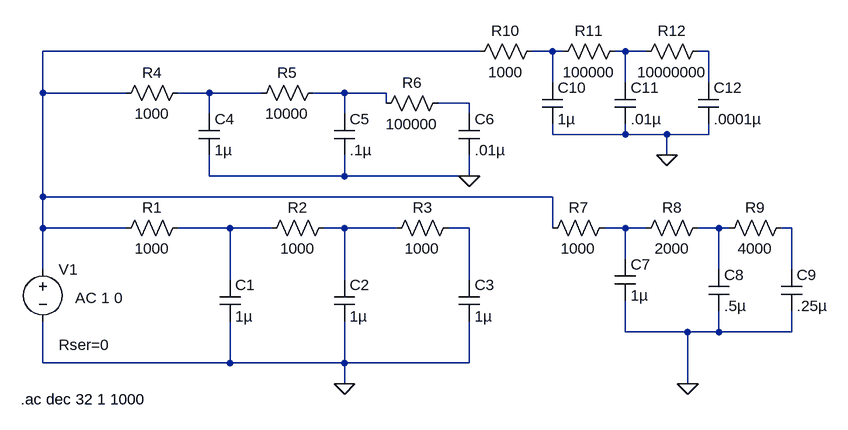
[diagram p0: schematic RCladder1.asc]
RCladder1.asc, the LTspice schematic file:
Version 4
SHEET 1 1252 680
WIRE 656 -192 -16 -192
WIRE 768 -192 736 -192
WIRE 784 -192 768 -192
WIRE 880 -192 864 -192
WIRE 912 -192 880 -192
WIRE 1008 -192 992 -192
WIRE 768 -144 768 -192
WIRE 880 -144 880 -192
WIRE 1008 -144 1008 -192
WIRE -16 -128 -16 -192
WIRE 112 -128 -16 -128
WIRE 240 -128 192 -128
WIRE 320 -128 240 -128
WIRE 448 -128 400 -128
WIRE 512 -128 448 -128
WIRE 512 -112 512 -128
WIRE 640 -112 592 -112
WIRE 240 -96 240 -128
WIRE 448 -96 448 -128
WIRE 640 -96 640 -112
WIRE 768 -64 768 -80
WIRE 880 -64 880 -80
WIRE 880 -64 768 -64
WIRE 944 -64 880 -64
WIRE 1008 -64 1008 -80
WIRE 1008 -64 944 -64
WIRE 944 -32 944 -64
WIRE 240 0 240 -32
WIRE 448 0 448 -32
WIRE 448 0 240 0
WIRE 640 0 640 -32
WIRE 640 0 448 0
WIRE -16 32 -16 -128
WIRE 768 32 -16 32
WIRE -16 80 -16 32
WIRE 112 80 -16 80
WIRE 272 80 192 80
WIRE 336 80 272 80
WIRE 448 80 416 80
WIRE 528 80 448 80
WIRE 640 80 608 80
WIRE 768 80 768 32
WIRE 880 80 848 80
WIRE 912 80 880 80
WIRE 1024 80 992 80
WIRE 1040 80 1024 80
WIRE 1136 80 1120 80
WIRE 880 128 880 80
WIRE -16 144 -16 80
WIRE 1024 144 1024 80
WIRE 1136 144 1136 80
WIRE 272 160 272 80
WIRE 448 160 448 80
WIRE 640 160 640 80
WIRE 880 240 880 192
WIRE 976 240 880 240
WIRE 1024 240 1024 208
WIRE 1024 240 976 240
WIRE 1136 240 1136 208
WIRE 1136 240 1024 240
WIRE -16 288 -16 224
WIRE 272 288 272 224
WIRE 272 288 -16 288
WIRE 448 288 448 224
WIRE 448 288 272 288
WIRE 640 288 640 224
WIRE 640 288 448 288
WIRE 448 320 448 288
WIRE 976 320 976 240
FLAG 448 320 0
FLAG 976 320 0
FLAG 640 0 0
FLAG 944 -32 0
SYMBOL voltage -16 128 R0
WINDOW 123 50 60 Left 0
WINDOW 39 24 132 Left 0
WINDOW 3 24 44 Left 0
SYMATTR Value2 AC 1 0
SYMATTR SpiceLine Rser=0
SYMATTR InstName V1
SYMATTR Value ""
SYMBOL cap 256 160 R0
SYMATTR InstName C1
SYMATTR Value 1µ
SYMATTR SpiceLine Rser=0.001
SYMBOL cap 432 160 R0
SYMATTR InstName C2
SYMATTR Value 1µ
SYMBOL cap 624 160 R0
SYMATTR InstName C3
SYMATTR Value 1µ
SYMBOL res 208 64 R90
WINDOW 0 0 56 VBottom 0
WINDOW 3 32 56 VTop 0
SYMATTR InstName R1
SYMATTR Value 1000
SYMBOL res 432 64 R90
WINDOW 0 0 56 VBottom 0
WINDOW 3 32 56 VTop 0
SYMATTR InstName R2
SYMATTR Value 1000
SYMBOL res 624 64 R90
WINDOW 0 0 56 VBottom 0
WINDOW 3 32 56 VTop 0
SYMATTR InstName R3
SYMATTR Value 1000
SYMBOL res 208 -144 R90
WINDOW 0 0 56 VBottom 0
WINDOW 3 32 56 VTop 0
SYMATTR InstName R4
SYMATTR Value 1000
SYMBOL res 416 -144 R90
WINDOW 0 0 56 VBottom 0
WINDOW 3 32 56 VTop 0
SYMATTR InstName R5
SYMATTR Value 10000
SYMBOL res 608 -128 R90
WINDOW 0 0 56 VBottom 0
WINDOW 3 32 56 VTop 0
SYMATTR InstName R6
SYMATTR Value 100000
SYMBOL cap 224 -96 R0
SYMATTR InstName C4
SYMATTR Value 1µ
SYMATTR SpiceLine Rser=0.001
SYMBOL cap 432 -96 R0
SYMATTR InstName C5
SYMATTR Value .1µ
SYMBOL cap 624 -96 R0
SYMATTR InstName C6
SYMATTR Value .01µ
SYMBOL res 864 64 R90
WINDOW 0 0 56 VBottom 0
WINDOW 3 32 56 VTop 0
SYMATTR InstName R7
SYMATTR Value 1000
SYMBOL res 1008 64 R90
WINDOW 0 0 56 VBottom 0
WINDOW 3 32 56 VTop 0
SYMATTR InstName R8
SYMATTR Value 2000
SYMBOL res 1136 64 R90
WINDOW 0 0 56 VBottom 0
WINDOW 3 32 56 VTop 0
SYMATTR InstName R9
SYMATTR Value 4000
SYMBOL cap 864 128 R0
SYMATTR InstName C7
SYMATTR Value 1µ
SYMATTR SpiceLine Rser=0.001
SYMBOL cap 1008 144 R0
SYMATTR InstName C8
SYMATTR Value .5µ
SYMBOL cap 1120 144 R0
SYMATTR InstName C9
SYMATTR Value .25µ
SYMBOL res 752 -208 R90
WINDOW 0 0 56 VBottom 0
WINDOW 3 32 56 VTop 0
SYMATTR InstName R10
SYMATTR Value 1000
SYMBOL res 880 -208 R90
WINDOW 0 0 56 VBottom 0
WINDOW 3 32 56 VTop 0
SYMATTR InstName R11
SYMATTR Value 100000
SYMBOL res 1008 -208 R90
WINDOW 0 0 56 VBottom 0
WINDOW 3 32 56 VTop 0
SYMATTR InstName R12
SYMATTR Value 10000000
SYMBOL cap 752 -144 R0
SYMATTR InstName C10
SYMATTR Value 1µ
SYMATTR SpiceLine Rser=0.001
SYMBOL cap 864 -144 R0
SYMATTR InstName C11
SYMATTR Value .01µ
SYMBOL cap 992 -144 R0
SYMATTR InstName C12
SYMATTR Value .0001µ
TEXT -50 344 Left 0 !.ac dec 32 1 1000

The netlist it stands for:
* RCladder1.asc
V1 N001 0 AC 1 0 Rser=0
C1 N008 0 1µ Rser=0.001
C2 N009 0 1µ
C3 N010 0 1µ
R1 N008 N001 1000
R2 N009 N008 1000
R3 N010 N009 1000
R4 N005 N001 1000
R5 N006 N005 10000
R6 N007 N006 100000
C4 N005 0 1µ Rser=0.001
C5 N006 0 .1µ
C6 N007 0 .01µ
R7 N011 N001 1000
R8 N012 N011 2000
R9 N013 N012 4000
C7 N011 0 1µ Rser=0.001
C8 N012 0 .5µ
C9 N013 0 .25µ
R10 N002 N001 1000
R11 N003 N002 100000
R12 N004 N003 10000000
C10 N002 0 1µ Rser=0.001
C11 N003 0 .01µ
C12 N004 0 .0001µ
.ac dec 32 1 1000
.backanno
.end